# Altium project PCB_Project.PrjPCB
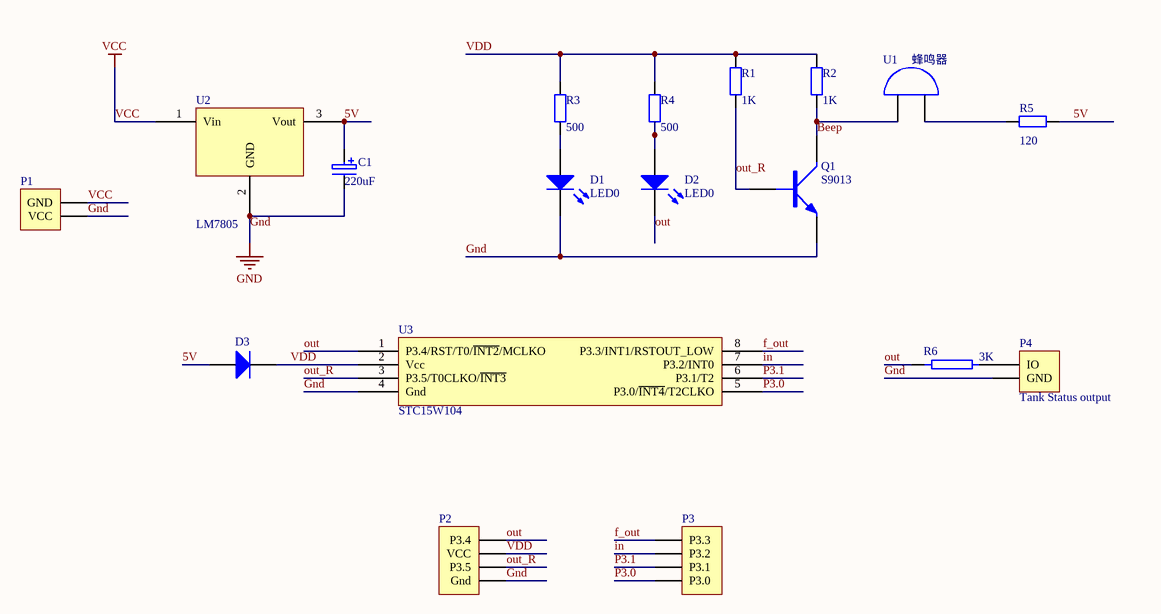
[diagram p0: 主板.SchDoc]
1 sheet, 18 parts. Net scope: global (net labels, ports and power ports of the same name join across sheets).

## Sheet 主板.SchDoc
size A4

### Parts
C1  value 220uF  [RB1]  (hidden comment: CAP3)
D1  LED0  [LED-0]
D2  LED0  [LED-0]
D3  1N4007  [DO-41]  (value not drawn)
P1  Header 2  [HDR1X2]  (value not drawn)
P2  Header 4  [HDR1X4]  (value not drawn)
P3  Header 4  [HDR1X4]  (value not drawn)
P4  Tank Status output  [HDR1X2]
Q1  S9013  [TO92A]
R1  value 1K  [AXIAL-0.4]  (hidden comment: Res2)
R2  value 1K  [AXIAL-0.4]  (hidden comment: Res2)
R3  value 500  [AXIAL-0.4]  (hidden comment: Res2)
R4  value 500  [AXIAL-0.4]  (hidden comment: Res2)
R5  value 120  [AXIAL-0.4]  (hidden comment: Res2)
R6  3K  [AXIAL0.4]
U1  蜂鸣器
U2  LM7805  [TO257V]
U3  STC15W104  [DFN8]

### Nets
Gnd: C1.2 D1.2(K) P1.1(VCC) P2.4(Gnd) P4.2(GND) Q1.1(E) U2.2(GND) U3.4(Gnd)
VCC: P1.2(GND) U2.1(Vin)
5V: C1.1 D3.1(A) R5.2 U2.3(Vout)
Beep: Q1.3(C) R2.1 U1.1(A)
f_out: P3.1(P3.3) U3.8(P3.3/INT1/RSTOUT_LOW)
in: P3.2(P3.2) U3.7(P3.2/INT0)
out: D2.2(K) P2.1(P3.4) R6.1 U3.1(P3.4/RST/T0/~{INT2}/MCLKO)
out_R: P2.3(P3.5) Q1.2(B) R1.1 U3.3(P3.5/T0CLKO/~{INT3})
P3.0: P3.4(P3.0) U3.5(P3.0/~{INT4}/T2CLKO)
P3.1: P3.3(P3.1) U3.6(P3.1/T2)
VDD: D3.2(K) P2.2(VCC) R1.2 R2.2 R3.2 R4.2 U3.2(Vcc)
NetD1_1: D1.1(A) R3.1
NetD2_1: D2.1(A) R4.1
NetP4_1: P4.1(IO) R6.2
NetR5_1: R5.1 U1.2(B)

### Library data of the parts
D1 D2 = LED0: Typical INFRARED GaAs LED; Published: 8-Jun-2000; LatestRevisionDate: 08-Jul-2005; LatestRevisionNote: Mech Layer 1 removed.; PackageReference: LED-0; Publisher: Altium Limited; PackageDescription: LED; 2 Leads
D3 = Diode 1N4007: 1 Amp General Purpose Rectifier; Published: 8-Jun-2000; LatestRevisionDate: 17-Jul-2002; LatestRevisionNote: Re-released for DXP Platform.; DatasheetVersion: 1998; PackageVersion: Aug-1999; PackageReference: DO-41; Publisher: Altium Limited; PackageDescription: Diode, Axial; Body 5.2 x 2.7 mm (LxDia. max), Lead Dia. 0.86 mm (max); Code_JEDEC: DO-204-AL; ComponentLink1Description: Manufacturer Link; ComponentLink1URL: http://www.fairchildsemi.com/; ComponentLink2Description: Datasheet; ComponentLink2URL: http://www.fairchildsemi.com/ds/1N%2F1N4001.pdf
P1 P4 = Header 2: Header, 2-Pin; LatestRevisionDate: 17-Jul-2002; LatestRevisionNote: Re-released for DXP Platform.; Publisher: Altium Limited
P2 P3 = Header 4: Header, 4-Pin; LatestRevisionDate: 17-Jul-2002; LatestRevisionNote: Re-released for DXP Platform.; Publisher: Altium Limited
Q1 = N: ?
R1-R5 = Res2: Resistor; Published: 8-Jun-2000; LatestRevisionDate: 17-Jul-2002; LatestRevisionNote: Re-released for DXP Platform.; PackageReference: AXIAL-0.4; Publisher: Altium Limited; PackageDescription: Axial Device, Thru-Hole; 2 Leads; 0.4 in Pin Spacing
R6 = R
U1 = 蜂鸣器: Bell
U2 = 78**
U3 = STC15W10x_DIP8_SOP8_DFN8